# Altium schematic sheet TEST_BTB.SchDoc
size A4; SheetNumber: 1; SheetTotal: 1
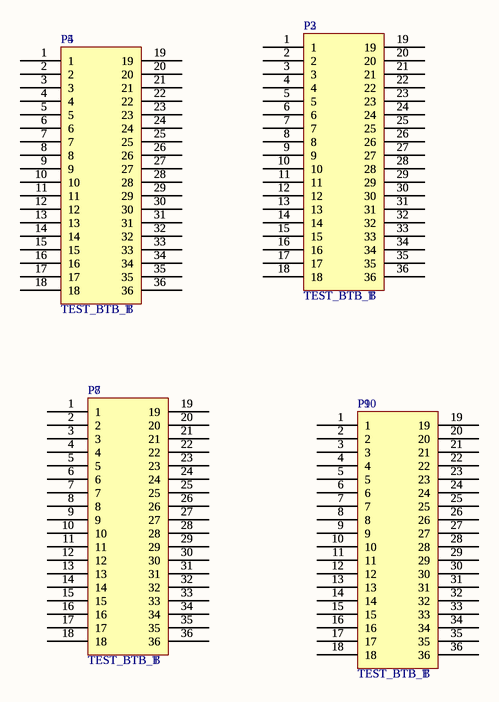
[diagram p0: TEST_BTB.SchDoc]

## Parts
P2  TEST_BTB_T  [TEST_BTB_T]
P3  TEST_BTB_B  [TEST_BTB_B]
P4  TEST_BTB_T  [TEST_BTB_T]
P5  TEST_BTB_B  [TEST_BTB_B]
P7  TEST_BTB_B  [TEST_BTB_B]
P8  TEST_BTB_T  [TEST_BTB_T]
P9  TEST_BTB_B  [TEST_BTB_B]
P10  TEST_BTB_T  [TEST_BTB_T]

## Nets
NetP2_1: P2.1 P3.1
NetP2_2: P2.2 P3.2
NetP2_3: P2.3 P3.3
NetP2_4: P2.4 P3.4
NetP2_5: P2.5 P3.5
NetP2_6: P2.6 P3.6
NetP2_7: P2.7 P3.7
NetP2_8: P2.8 P3.8
NetP2_9: P2.9 P3.9
NetP2_10: P2.10 P3.10
NetP2_11: P2.11 P3.11
NetP2_12: P2.12 P3.12
NetP2_13: P2.13 P3.13
NetP2_14: P2.14 P3.14
NetP2_15: P2.15 P3.15
NetP2_16: P2.16 P3.16
NetP2_17: P2.17 P3.17
NetP2_18: P2.18 P3.18
NetP2_19: P2.19 P3.19
NetP2_20: P2.20 P3.20
NetP2_21: P2.21 P3.21
NetP2_22: P2.22 P3.22
NetP2_23: P2.23 P3.23
NetP2_24: P2.24 P3.24
NetP2_25: P2.25 P3.25
NetP2_26: P2.26 P3.26
NetP2_27: P2.27 P3.27
NetP2_28: P2.28 P3.28
NetP2_29: P2.29 P3.29
NetP2_30: P2.30 P3.30
NetP2_31: P2.31 P3.31
NetP2_32: P2.32 P3.32
NetP2_33: P2.33 P3.33
NetP2_34: P2.34 P3.34
NetP2_35: P2.35 P3.35
NetP2_36: P2.36 P3.36
NetP4_1: P4.1 P5.1
NetP4_2: P4.2 P5.2
NetP4_3: P4.3 P5.3
NetP4_4: P4.4 P5.4
NetP4_5: P4.5 P5.5
NetP4_6: P4.6 P5.6
NetP4_7: P4.7 P5.7
NetP4_8: P4.8 P5.8
NetP4_9: P4.9 P5.9
NetP4_10: P4.10 P5.10
NetP4_11: P4.11 P5.11
NetP4_12: P4.12 P5.12
NetP4_13: P4.13 P5.13
NetP4_14: P4.14 P5.14
NetP4_15: P4.15 P5.15
NetP4_16: P4.16 P5.16
NetP4_17: P4.17 P5.17
NetP4_18: P4.18 P5.18
NetP4_19: P4.19 P5.19
NetP4_20: P4.20 P5.20
NetP4_21: P4.21 P5.21
NetP4_22: P4.22 P5.22
NetP4_23: P4.23 P5.23
NetP4_24: P4.24 P5.24
NetP4_25: P4.25 P5.25
NetP4_26: P4.26 P5.26
NetP4_27: P4.27 P5.27
NetP4_28: P4.28 P5.28
NetP4_29: P4.29 P5.29
NetP4_30: P4.30 P5.30
NetP4_31: P4.31 P5.31
NetP4_32: P4.32 P5.32
NetP4_33: P4.33 P5.33
NetP4_34: P4.34 P5.34
NetP4_35: P4.35 P5.35
NetP4_36: P4.36 P5.36
NetP7_1: P7.1 P8.1
NetP7_2: P7.2 P8.2
NetP7_3: P7.3 P8.3
NetP7_4: P7.4 P8.4
NetP7_5: P7.5 P8.5
NetP7_6: P7.6 P8.6
NetP7_7: P7.7 P8.7
NetP7_8: P7.8 P8.8
NetP7_9: P7.9 P8.9
NetP7_10: P7.10 P8.10
NetP7_11: P7.11 P8.11
NetP7_12: P7.12 P8.12
NetP7_13: P7.13 P8.13
NetP7_14: P7.14 P8.14
NetP7_15: P7.15 P8.15
NetP7_16: P7.16 P8.16
NetP7_17: P7.17 P8.17
NetP7_18: P7.18 P8.18
NetP7_19: P7.19 P8.19
NetP7_20: P7.20 P8.20
NetP7_21: P7.21 P8.21
NetP7_22: P7.22 P8.22
NetP7_23: P7.23 P8.23
NetP7_24: P7.24 P8.24
NetP7_25: P7.25 P8.25
NetP7_26: P7.26 P8.26
NetP7_27: P7.27 P8.27
NetP7_28: P7.28 P8.28
NetP7_29: P7.29 P8.29
NetP7_30: P7.30 P8.30
NetP7_31: P7.31 P8.31
NetP7_32: P7.32 P8.32
NetP7_33: P7.33 P8.33
NetP7_34: P7.34 P8.34
NetP7_35: P7.35 P8.35
NetP7_36: P7.36 P8.36
NetP9_1: P9.1 P10.1
NetP9_2: P9.2 P10.2
NetP9_3: P9.3 P10.3
NetP9_4: P9.4 P10.4
NetP9_5: P9.5 P10.5
NetP9_6: P9.6 P10.6
NetP9_7: P9.7 P10.7
NetP9_8: P9.8 P10.8
NetP9_9: P9.9 P10.9
NetP9_10: P9.10 P10.10
NetP9_11: P9.11 P10.11
NetP9_12: P9.12 P10.12
NetP9_13: P9.13 P10.13
NetP9_14: P9.14 P10.14
NetP9_15: P9.15 P10.15
NetP9_16: P9.16 P10.16
NetP9_17: P9.17 P10.17
NetP9_18: P9.18 P10.18
NetP9_19: P9.19 P10.19
NetP9_20: P9.20 P10.20
NetP9_21: P9.21 P10.21
NetP9_22: P9.22 P10.22
NetP9_23: P9.23 P10.23
NetP9_24: P9.24 P10.24
NetP9_25: P9.25 P10.25
NetP9_26: P9.26 P10.26
NetP9_27: P9.27 P10.27
NetP9_28: P9.28 P10.28
NetP9_29: P9.29 P10.29
NetP9_30: P9.30 P10.30
NetP9_31: P9.31 P10.31
NetP9_32: P9.32 P10.32
NetP9_33: P9.33 P10.33
NetP9_34: P9.34 P10.34
NetP9_35: P9.35 P10.35
NetP9_36: P9.36 P10.36